# EAGLE design hvac-sensors-v2 (EAGLE 6.4)
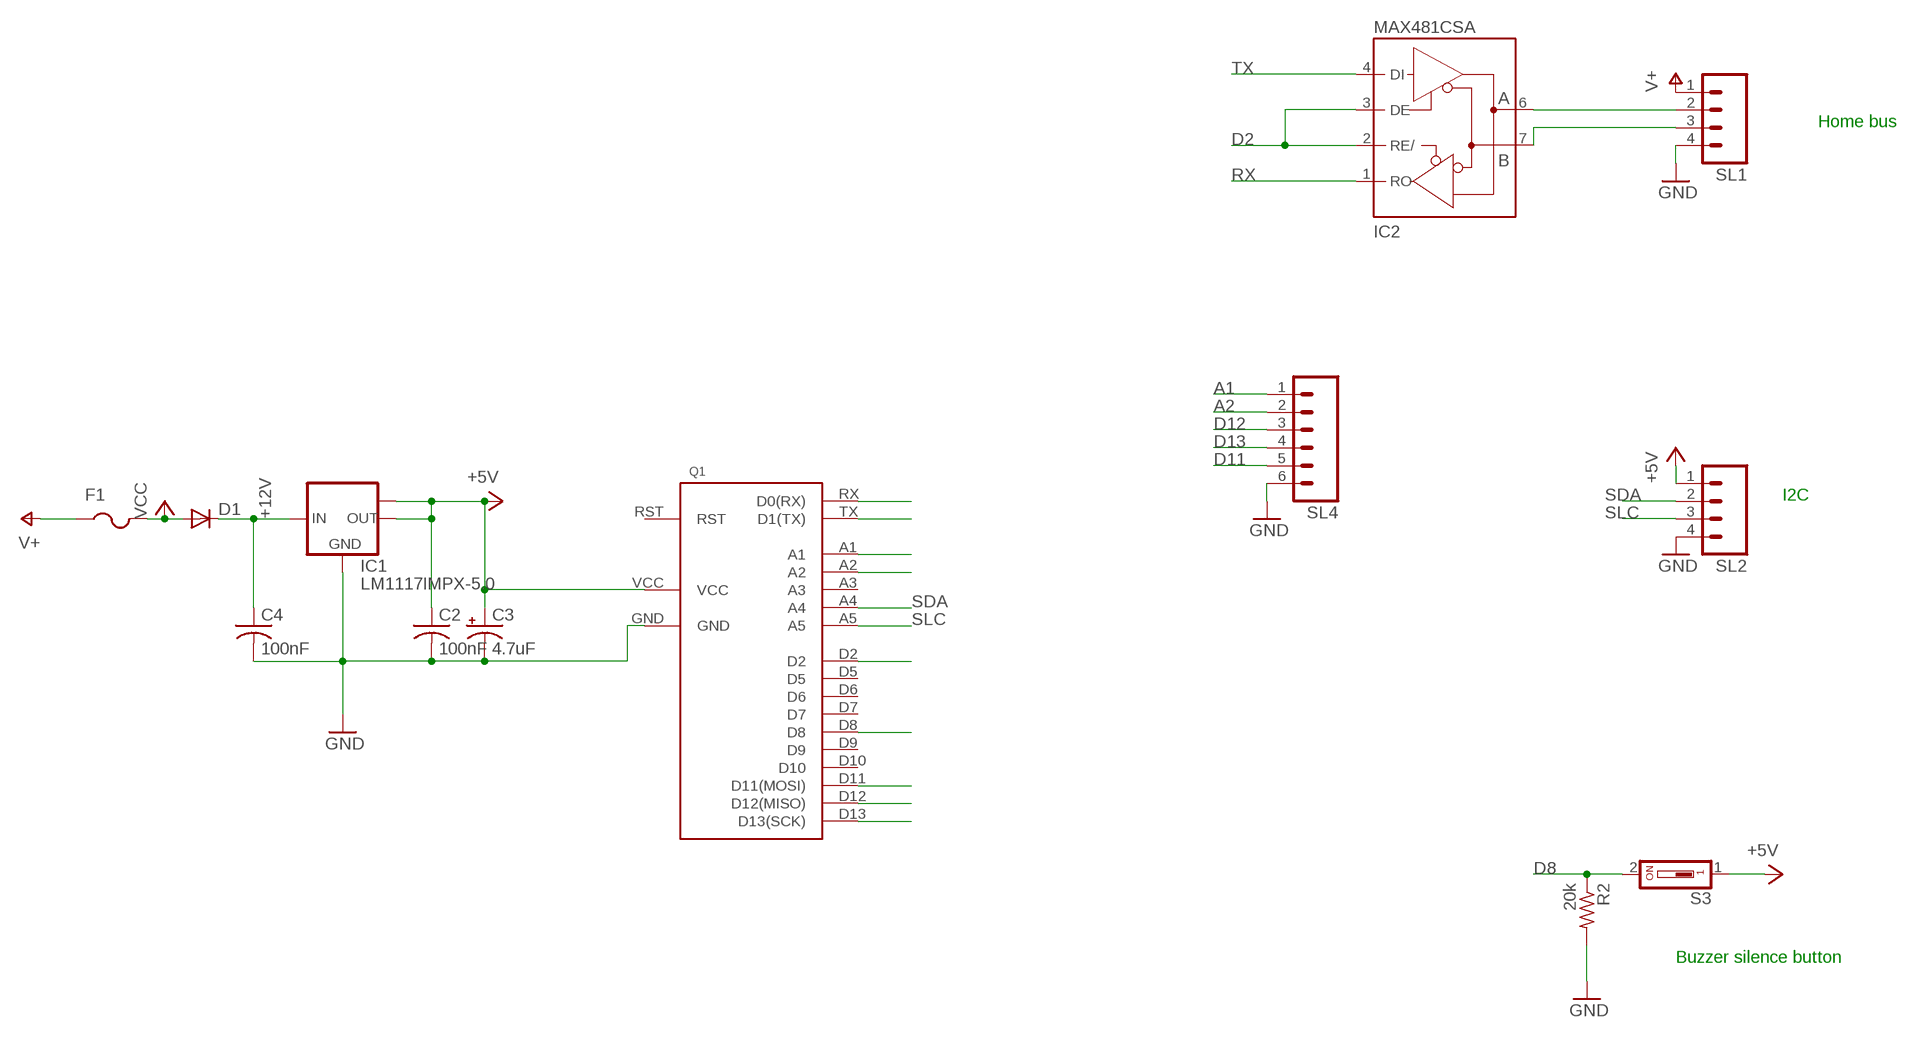
[diagram p0: schematic, sheet 1]

## Parts
C2  100nF  C-USC0603K  [C0603K]
C3  4.7uF  CPOL-USE1.8-4  [E1,8-4]
C4  100nF  C-USC0603K  [C0603K]
D1  DIODE-MICROMELF-W  [MICROMELF-W]
F1  PTCFUSE-1812  [1812]
IC1  LM1117IMPX-5.0  [SOT223]
IC2  MAX481CSA  [SO08]
Q1  HOME-CPU-V1  [HOME-CPU-V1]
R2  20k  R-US_R0603  [R0603]
S3  DS01  [DS-01]
SL1  M04  [04P]
SL2  M04  [04P]
SL4  M06  [06P]

## Nets
+12V: C4.1 D1.C IC1.3(IN)
A1: Q1.A1 SL4.1
A2: Q1.A2 SL4.2
D2: IC2.2(RE/) IC2.3(DE) Q1.D2
D8: Q1.D8 R2.1 S3.2
D11: Q1.D11(D11(MOSI)) SL4.5
D12: Q1.D12(D12(MISO)) SL4.3
D13: Q1.D13(D13(SCK)) SL4.4
GND: C2.2 C3.- C4.2 IC1.1(GND) Q1.GND R2.2 SL1.4 SL2.4 SL4.6
N$1: D1.A F1.2 ; supply symbol labelled VCC
N$3: IC2.6(A) SL1.2
N$4: IC2.7(B) SL1.3
RX: IC2.1(RO) Q1.RX(D0(RX))
SDA: Q1.A4 SL2.2
SLC: Q1.A5 SL2.3
TX: IC2.4(DI) Q1.TX(D1(TX))
V+: F1.1 SL1.1
VCC: C2.1 C3.+ IC1.2(OUT) IC1.TAB(OUT1) Q1.VCC S3.1 SL2.1 ; supply symbol labelled +5V
Unconnected: Q1.A3 Q1.D5 Q1.D6 Q1.D7 Q1.D9 Q1.D10 Q1.RST

## Notes on the sheet
- Home bus
- I2C
- Buzzer silence button

## Power pins joined to a net without a drawn wire
GND: IC2.5(GND)
VCC: IC2.8(VCC)

## Library data of the parts
C2 C4 = adafruit:C-US: CAPACITOR, American symbol
C3 = adafruit:CPOL-US: POLARIZED CAPACITOR, American symbol
D1 = diode:DIODE-: DIODE
F1 = adafruit:PTCFUSE: PTC fuses, resettable thermistors
IC1 = lm1117:LM1117IMPX-*
IC2 = maxim:MAX481CSA: RS485 TRANSEIVER; MF: MAXIM; MPN: MAX481CSA; OC_FARNELL: unknown; OC_NEWARK: 90C3817
Q1 = serge:HOME-CPU-V1
R2 = adafruit:R-US_: RESISTOR, American symbol
S3 = switch-dil:DS01: DIL/CODE SWITCH; OC_FARNELL: unknown; OC_NEWARK: unknown
SL1 SL2 = con-amp-quick:M04: AMP QUICK CONNECTOR; OC_FARNELL: unknown; OC_NEWARK: unknown
SL4 = con-amp-quick:M06: AMP QUICK CONNECTOR; OC_FARNELL: unknown; OC_NEWARK: unknown

## Board
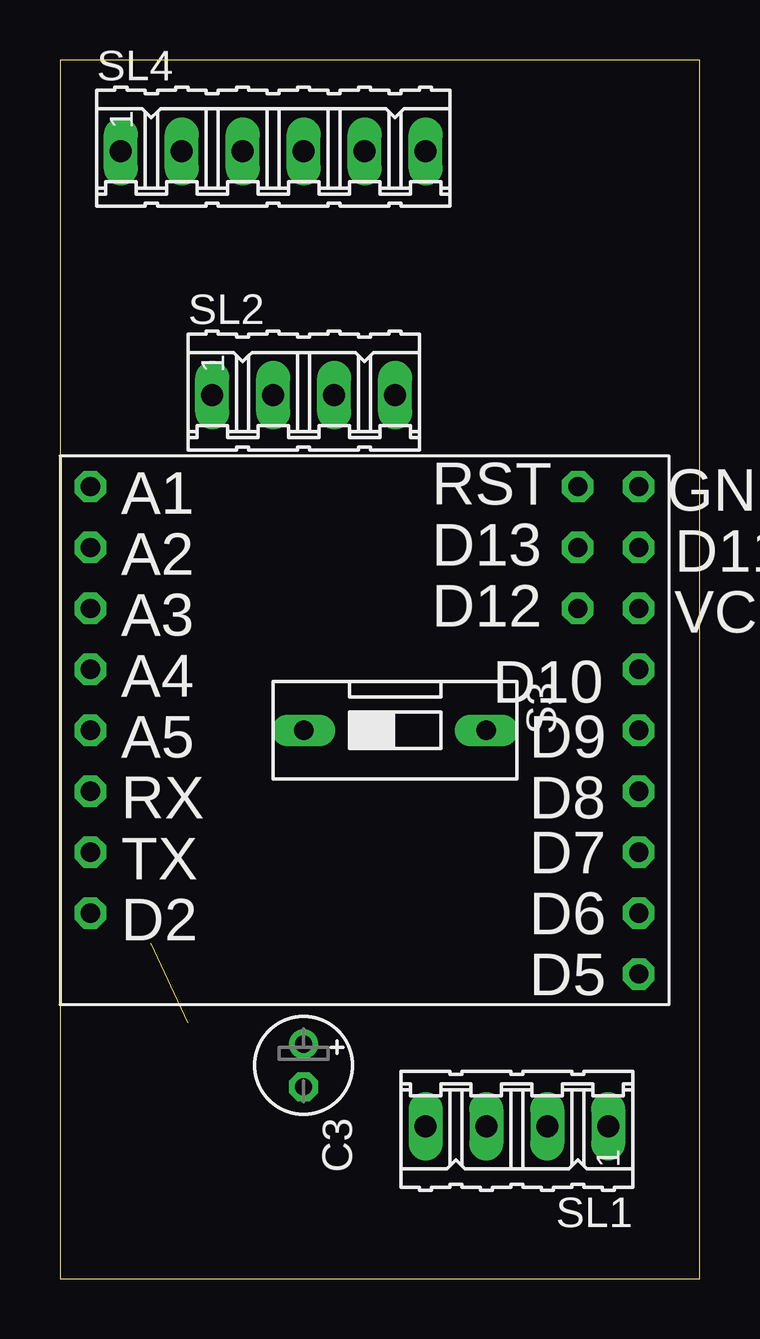
[diagram p1: board, top side]
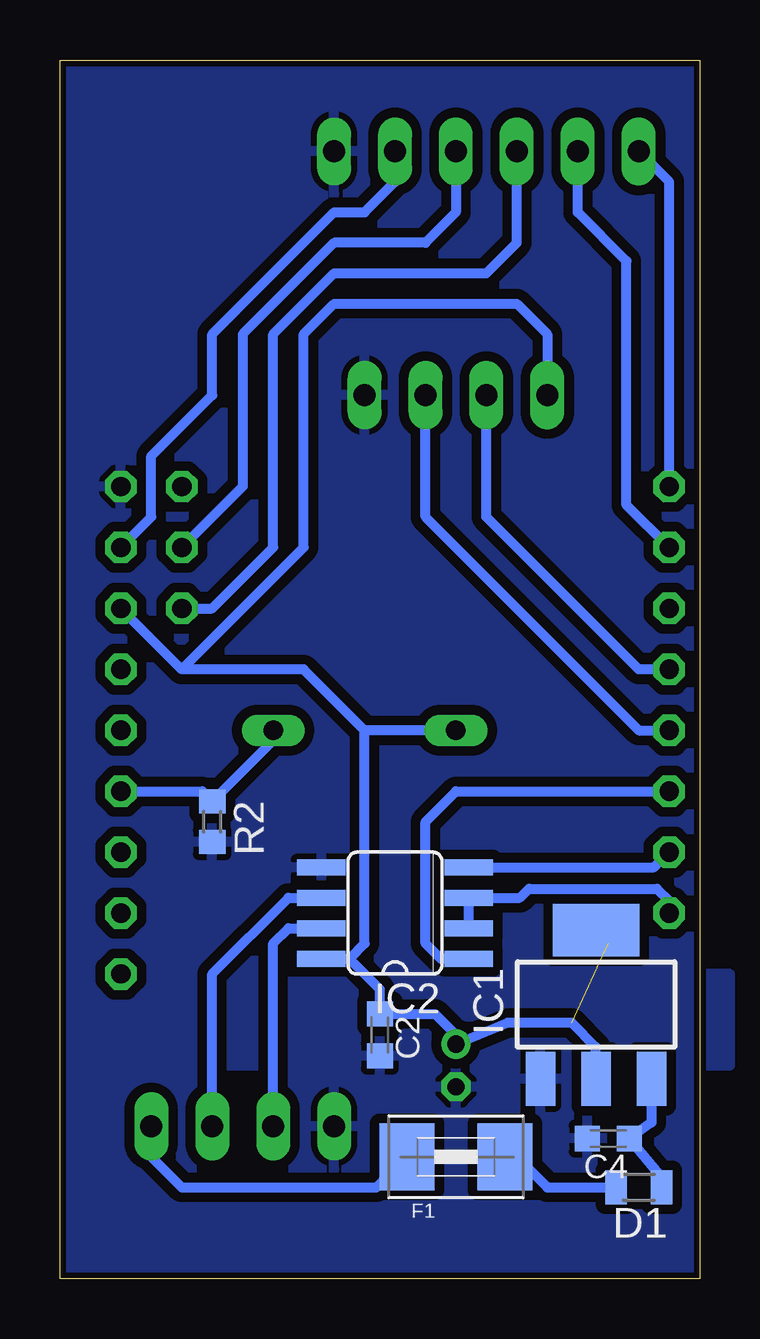
[diagram p2: board, bottom side, seen from below]

Size 26.67 x 50.8 mm. Coordinates in mm from the lower left corner, seen from the top.
Outline: 0,0 26.67,0 26.67,50.8 0,50.8 0,0
Copper layers (1*16): Top 0.035mm / dielectric 1.5mm / Bottom 0.035mm
Design rules "default *": minimum track width 10mil, minimum drill 24mil, track to track 16mil, track to pad 16mil, pad to pad 16mil, via to via 16mil, smd to smd 16mil, copper to edge 10mil, drill to drill 8mil, minimum pad ring 10mil, minimum via ring 8mil, stop-mask expansion 4mil, vias tented up to drill 0mil, thermal gap 10mil

### Footprints (pad centres in the part's own frame; a part is rotated, then mirrored left to right if it is on the bottom)
C0603K = smd 1.05 x 1.08: 1 -0.875,0; 2 0.875,0
E1,8-4 = drill 0.711 pad 1.168: + -0.889,0 | drill 0.711 pad 1.168 octagon: - 0.889,0
MICROMELF-W = smd 0.9 x 1.4: A 0.95,0; C -0.95,0
1812 = smd 2.286 x 2.794: 1 -2.046,0; 2 2.046,0
SOT223 = smd 1.219 x 2.235: 1 -2.311,-3.099; 2 0,-3.099; 3 2.311,-3.099 | smd 3.6 x 2.2: TAB 0,3.099
SO08 = smd 0.66 x 2.032: 1 -1.905,-3.073; 2 -0.635,-3.073; 3 0.635,-3.073; 4 1.905,-3.073; 5 1.905,3.073; 6 0.635,3.073; 7 -0.635,3.073; 8 -1.905,3.073
HOME-CPU-V1 = drill 0.8 octagon: A1 5.08,22.86; A2 2.54,22.86; A3 0,22.86; A4 -2.54,22.86; A5 -5.08,22.86; D2 -12.7,22.86; D5 -15.24,0; D6 -12.7,0; D7 -10.16,0; D8 -7.62,0; D9 -5.08,0; D10 -2.54,0; D11 2.54,0; D12 0,2.54; D13 2.54,2.54; GND 5.08,0; RST 5.08,2.54; RX -7.62,22.86; TX -10.16,22.86; VCC 0,0
R0603 = smd 1 x 1.1: 1 -0.85,0; 2 0.85,0
DS-01 = drill 0.813 long: 1 0,-3.81; 2 0,3.81
04P = drill 0.914 long: 1 -3.81,0; 2 -1.27,0; 3 1.27,0; 4 3.81,0
06P = drill 0.914 long: 1 -6.35,0; 2 -3.81,0; 3 -1.27,0; 4 1.27,0; 5 3.81,0; 6 6.35,0

### Placement (x,y rotation side)
C2  13.34,10.16 270 bottom
C3  10.16,8.89 270 top
C4  3.81,5.84 180 bottom
D1  2.54,3.81 180 bottom
F1  10.16,5.08 0 bottom
IC1  4.32,11.43 0 bottom
IC2  12.7,15.24 90 bottom
Q1  24.13,27.94 90 top
R2  20.32,19.05 270 bottom
S3  13.97,22.86 270 top
SL1  19.05,6.35 180 top
SL2  10.16,36.83 0 top
SL4  8.89,46.99 0 top

### Tracks (layer width: path | path; a pad name or v marks a point on that pad's centre or on a via)
+12V
  Bottom 0.406: D1.C 1.59,4.24 C4.1 2.01,6.52 IC1.3
A1
  Bottom 0.406: Q1.A1 1.27,45.72 SL4.1
A2
  Bottom 0.406: Q1.A2 3.05,32.26 3.05,42.42 5.08,44.45 SL4.2
D2
  Bottom 0.406: IC2.2 IC2.3 7.49,15.88 7.11,16.26 1.78,16.26 1.27,15.75 Q1.D2
D8
  Bottom 0.406: Q1.D8 20.74,20.32 R2.1 17.78,22.44 S3.2
D11
  Bottom 0.406: Q1.D11 22.86,31.75 22.86,34.29 20.32,36.83 20.32,39.37 15.24,44.45 13.97,44.45 12.7,45.72 SL4.5
D12
  Bottom 0.406: Q1.D12 20.32,27.94 17.78,30.48 17.78,39.37 15.24,41.91 8.89,41.91 7.62,43.18 SL4.3
D13
  Bottom 0.406: SL4.4 10.16,44.45 11.43,43.18 15.24,43.18 19.05,39.37 19.05,33.02 Q1.D13
GND
  pour Bottom: 0,0 26.67,0 26.67,50.8 0,50.8
N$1
  Bottom 0.406: F1.2 7.62,5.08 6.35,3.81 D1.A
N$2
  pour Bottom: 0,13.97 0,48.26 22.86,48.26 22.86,26.67 22.86,8.89 -1.27,8.89 -1.27,12.7 0,12.7
N$3
  Bottom 0.406: 15.88,15.88 IC2.6 17.14,15.88 20.32,12.7 SL1.2
N$4
  Bottom 0.406: 15.88,14.61 IC2.7 17.14,14.61 17.78,13.97 SL1.3
RX
  Bottom 0.406: IC2.1 10.79,13.34 11.43,13.97 11.43,19.05 10.16,20.32 Q1.RX
SDA
  Bottom 0.406: Q1.A4 2.54,25.4 8.89,31.75 SL2.2
SLC
  Bottom 0.406: Q1.A5 2.54,22.86 11.43,31.75 SL2.3
TX
  Bottom 0.406: IC2.4 1.91,17.14 Q1.TX
V+
  Bottom 0.406: SL1.1 22.86,5.08 21.59,3.81 13.48,3.81 F1.1
VCC  (1 unrouted)
  Bottom 0.406: 3.81,13.97 IC1.TAB | 13.97,22.86 13.97,13.97 14.61,13.34 | IC2.8 14.61,13.34 | 14.61,13.34 13.34,12.06 C2.1 11.04,11.04 10.16,10.16 C3.+ 8,10.67 5.33,10.67 4.32,9.65 IC1.2 | S3.1 13.97,22.86 | Q1.VCC 21.59,25.4 | SL2.1 6.35,39.37 7.62,40.64 15.24,40.64 16.51,39.37 16.51,30.48 21.59,25.4 | 13.97,22.86 16.51,25.4 21.59,25.4